# Altium schematic sheet LEDcircuits_PWM.SchDoc
size A4; CompanyName: Technische Hochschule Nürnberg Georg Simon Ohm; Organization: UltraZohm; Address1: Kesslerplatz 12; Address2: 90489 Nürnberg; Address3: GERMANY; SheetNumber: 4; SheetTotal: 5; Website: www.ultrazohm.com
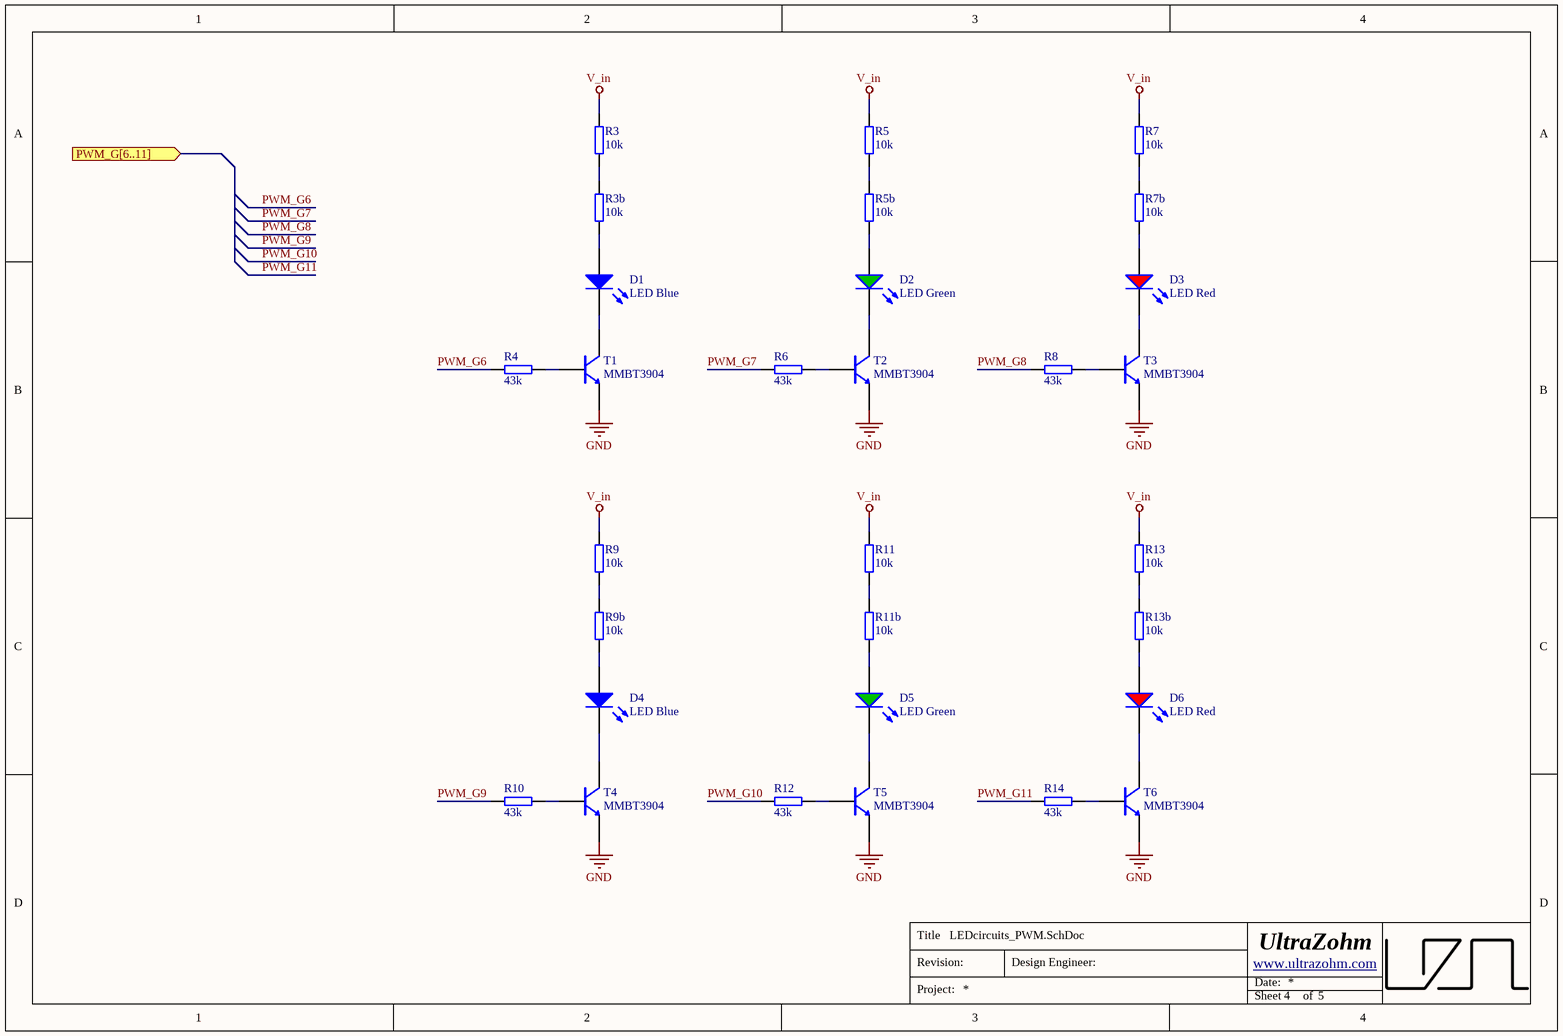
[diagram p0: LEDcircuits_PWM.SchDoc]

## Parts
D1  LED Blue  [WL-SMCW_0603]
D2  LED Green  [WL-SMCW_0603]
D3  LED Red  [WL-SMCW_0603]
D4  LED Blue  [WL-SMCW_0603]
D5  LED Green  [WL-SMCW_0603]
D6  LED Red  [WL-SMCW_0603]
R3  10k  [RES 0603_1608]
R3b  10k  [RES 0603_1608]
R4  43k  [RES 0603_1608]
R5  10k  [RES 0603_1608]
R5b  10k  [RES 0603_1608]
R6  43k  [RES 0603_1608]
R7  10k  [RES 0603_1608]
R7b  10k  [RES 0603_1608]
R8  43k  [RES 0603_1608]
R9  10k  [RES 0603_1608]
R9b  10k  [RES 0603_1608]
R10  43k  [RES 0603_1608]
R11  10k  [RES 0603_1608]
R11b  10k  [RES 0603_1608]
R12  43k  [RES 0603_1608]
R13  10k  [RES 0603_1608]
R13b  10k  [RES 0603_1608]
R14  43k  [RES 0603_1608]
T1  MMBT3904  [SOT95P280X145-3N]
T2  MMBT3904  [SOT95P280X145-3N]
T3  MMBT3904  [SOT95P280X145-3N]
T4  MMBT3904  [SOT95P280X145-3N]
T5  MMBT3904  [SOT95P280X145-3N]
T6  MMBT3904  [SOT95P280X145-3N]

## Ports
PWM_G[6..11] (in)

## Nets
GND: T1.2(EMITTER) T2.2(EMITTER) T3.2(EMITTER) T4.2(EMITTER) T5.2(EMITTER) T6.2(EMITTER)
V_in: R3.2 R5.2 R7.2 R9.2 R11.2 R13.2
PWM_G6: R4.1
PWM_G7: R6.1
PWM_G8: R8.1
PWM_G9: R10.1
PWM_G10: R12.1
PWM_G11: R14.1
NetD1_1: D1.1(K) T1.3(COLLECTOR)
NetD1_2: D1.2(A) R3b.1
NetD2_1: D2.1(K) T2.3(COLLECTOR)
NetD2_2: D2.2(A) R5b.1
NetD3_1: D3.1(K) T3.3(COLLECTOR)
NetD3_2: D3.2(A) R7b.1
NetD4_1: D4.1(K) T4.3(COLLECTOR)
NetD4_2: D4.2(A) R9b.1
NetD5_1: D5.1(K) T5.3(COLLECTOR)
NetD5_2: D5.2(A) R11b.1
NetD6_1: D6.1(K) T6.3(COLLECTOR)
NetD6_2: D6.2(A) R13b.1
NetR3_1: R3.1 R3b.2
NetR4_2: R4.2 T1.1(BASIS)
NetR5_1: R5.1 R5b.2
NetR6_2: R6.2 T2.1(BASIS)
NetR7_1: R7.1 R7b.2
NetR8_2: R8.2 T3.1(BASIS)
NetR9_1: R9.1 R9b.2
NetR10_2: R10.2 T4.1(BASIS)
NetR11_1: R11.1 R11b.2
NetR12_2: R12.2 T5.1(BASIS)
NetR13_1: R13.1 R13b.2
NetR14_2: R14.2 T6.1(BASIS)

## Notes on the sheet
- Title
- Revision:
- Design Engineer:
- Date:
- Project:
- Sheet
- of

## Library data of the parts
D1 D4 = UZgen_LED_0603_Blue: Standard LEDs - SMD 0603 blue; Manufacturer: UZgen; Created from: UZgenTool; Manufacturer Part Number: UZgen_LED_0603_Blue; PartID: 20; Created On: 09.09.2024 10:45:01; ComponentLink1Description: N/A; ComponentLink1URL: N/A; Component Type: LED Diode; Device Package: 0603; Last Updated: 09.09.2024 10:45:01; Mounting Type: SMD; Supplier 1: LCSC; Supplier Part Number 1: C5197644; Type: Standard; Value: LED Blue; Live Cycle Status: 1; Stock number: not stored; Color: blue; LCSC Part Number: C5197644
D2 D5 = UZgen_LED_0603_Green: Standard LEDs - SMD 0603 green; Manufacturer: UZgen; Created from: UZgenTool; Manufacturer Part Number: UZgen_LED_0603_Green; PartID: 21; Created On: 09.09.2024 10:45:01; ComponentLink1Description: N/A; ComponentLink1URL: N/A; Component Type: LED Diode; Device Package: 0603; Last Updated: 09.09.2024 10:45:01; Mounting Type: SMD; Supplier 1: LCSC; Supplier Part Number 1: C5252984; Type: Standard; Value: LED Green; Live Cycle Status: 1; Stock number: not stored; Color: green; LCSC Part Number: C5252984
D3 D6 = UZgen_LED_0603_Red: Standard LEDs - SMD 0603 red; Manufacturer: UZgen; Created from: UZgenTool; Manufacturer Part Number: UZgen_LED_0603_Red; PartID: 22; Created On: 09.09.2024 10:45:01; ComponentLink1Description: N/A; ComponentLink1URL: N/A; Component Type: LED Diode; Device Package: 0603; Last Updated: 09.09.2024 10:45:01; Mounting Type: SMD; Supplier 1: LCSC; Supplier Part Number 1: C3030991; Type: Standard; Value: LED Red; Live Cycle Status: 1; Stock number: not stored; Color: red; LCSC Part Number: C3030991
R3 R3b R5 R5b R7 R7b R9 R9b R11 R11b R13 R13b = RQ73C1J10KBTD: SMD resistor 0.1%, 10ppm; Manufacturer: TE Connectivity; Created from: DHufnagel; Manufacturer Part Number: RQ73C1J10KBTD; PartID: 231; Created On: 14.12.2020 16:17:14; ComponentLink1Description: Datasheet; ComponentLink1URL: https://www.mouser.de/datasheet/2/418/5/ENG_DS_1773270_2_B-1533717.pdf; Component Type: SMD resistor; Device Package: 0603; Last Updated: 21.02.2024 15:51:17; Mounting Type: SMD; Supplier 1: Mouser; Supplier Part Number 1: 279-RQ73C1J10KBTD; Supplier 2: LCSC; Supplier Part Number 2: C25804; Type: Resistor; Tolerance: 0.1%; Value: 10k; Live Cycle Status: 1; Stock number: not stored; LCSC Part Number: C25804
R4 R6 R8 R10 R12 R14 = RK73B1JTTD433J: SMD resistor E24 series; Manufacturer: KOA Speer; Tolerance: 5%; Created from: MGremer; Manufacturer Part Number: RK73B1JTTD433J; PartID: 113; Created On: 14.12.2020 16:17:14; ComponentLink1Description: Datasheet; ComponentLink1URL: https://www.mouser.de/datasheet/2/219/RK73B-1825463.pdf; Component Type: SMD resistor; Device Package: 0603; Last Updated: 15.02.2023 17:49:44; Mounting Type: SMD; Supplier 1: Mouser; Supplier Part Number 1: 660-RK73B1JTTD433J; Type: Resistor; Value: 43k; Live Cycle Status: 1; Stock number: Labor SMD Container; LCSC Part Number: C23172
T1-T6 = MMBT3904: Bipolartransistor, 40V 200mW 200mA 100@10mA,1V 300MHz 300mV@50mA,5mA NPN +150℃@(Tj) SOT-23(SOT-23-3); Manufacturer: Jiangsu Changjing Electronics Technology Co., Ltd.; Number Of Channels: single; Collector Basis Voltage: 60 V; Created from: NDiringer; Manufacturer Part Number: MMBT3904; PartID: 2; Created On: 10.06.2022 12:04:49; ComponentLink1Description: Datasheet; ComponentLink1URL: https://datasheet.lcsc.com/lcsc/1811011934_Jiangsu-Changjing-Electronics-Technology-Co---Ltd--MMBT3904_C20526.pdf; Component Type: Bipolartransistor; Device Package: SOT-23-3; Last Updated: 10.08.2022 13:48:16; Mounting Type: SMD; Operating Temperature: -55 - 150 °C; Series: MMBT3904; Supplier 1: Mouser; Supplier Part Number 1: MMBT3904; Type: Bipolartransistor; Collector Emitter Voltage: 40 V; Polarization: NPN; Power Dissipation: 200 mW; Value: 40 V; Live Cycle Status: 1; Supplier 2: LCSC/JLCPCB; Supplier Part Number 2: C20526; LCSC Part Number: C20526